# EAGLE schematic PIR_MOC_2 (EAGLE 6.6.0)
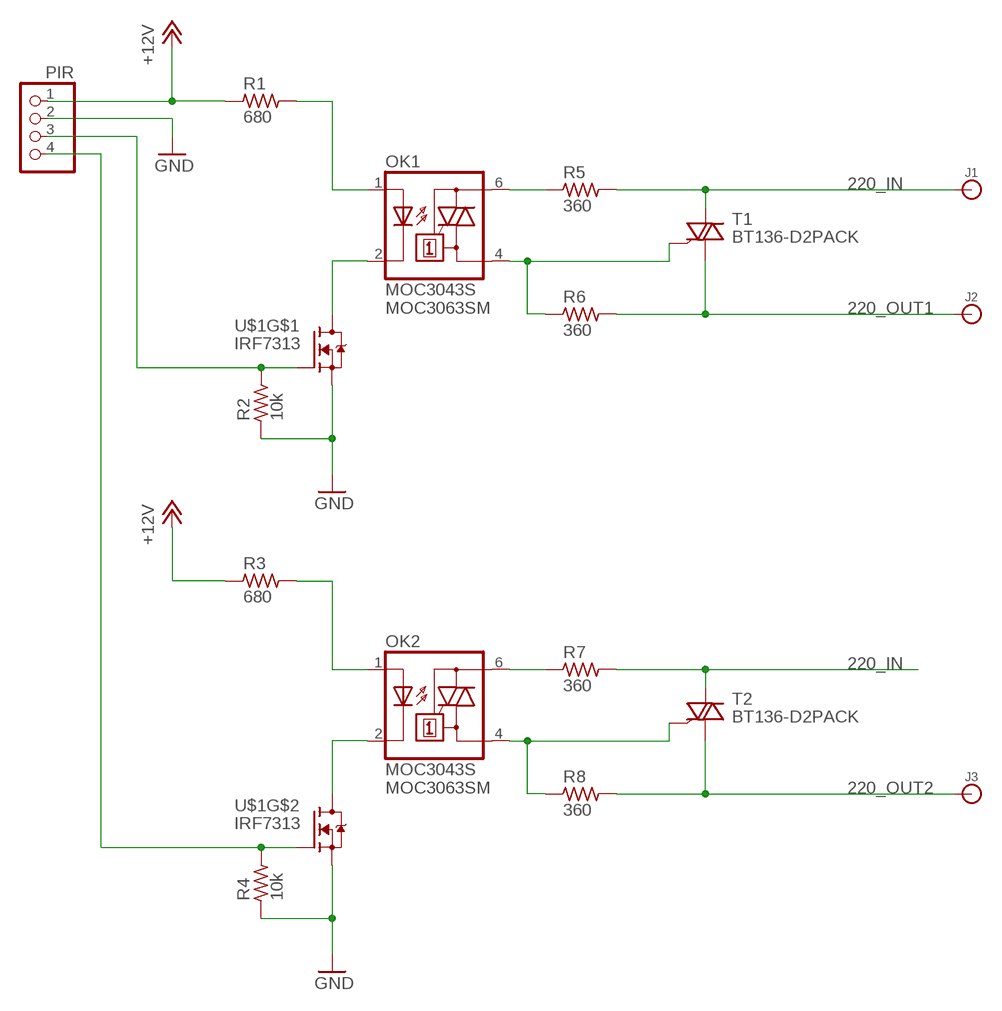
[diagram p0: schematic, sheet 1]

## Parts
J1  BANANA_CONN  [BANANA_CONN]
J2  BANANA_CONN  [BANANA_CONN]
J3  BANANA_CONN  [BANANA_CONN]
OK1  MOC3043S  [DIL6-SMD]
OK2  MOC3043S  [DIL6-SMD]
PIR  PINHD-1X04_2.54-S  [1X04-S]
R1  680  R_1206  [R1206]
R2  10k  R_1206  [R1206]
R3  680  R_1206  [R1206]
R4  10k  R_1206  [R1206]
R5  360  R_1206  [R1206]
R6  360  R_1206  [R1206]
R7  360  R_1206  [R1206]
R8  360  R_1206  [R1206]
T1  BT136-D2PACK  [TO263]
T2  BT136-D2PACK  [TO263]
U$1  IRF7313  [SO-8]

## Nets
220_IN: J1.P$1 R5.2 R7.2 T1.3(A2) T2.3(A2)
220_MOC_AC: OK1.6(A2) R5.1
220_MOC_AC1: OK2.6(A2) R7.1
220_MOC_N: OK1.4(A1) R6.1 T1.2(G)
220_MOC_N1: OK2.4(A1) R8.1 T2.2(G)
220_OUT1: J2.P$1 R6.2 T1.1(A1)
220_OUT2: J3.P$1 R8.2 T2.1(A1)
+12V: PIR.1 R1.1 R3.1
GND: PIR.2 R2.1 R4.1 U$1.1(S) U$1.3(S)
N$1: OK2.2(C) U$1.5(D) U$1.6(D)
N$2: OK2.1(A) R3.2
N$3: PIR.4 R4.2 U$1.4(G)
N$5: OK1.2(C) U$1.7(D) U$1.8(D)
N$6: OK1.1(A) R1.2
N$7: PIR.3 R2.2 U$1.2(G)

## Library data of the parts
J1-J3 = my-library:BANANA_CONN: Through-hole banana jack
OK1 OK2 = optocoupler:MOC30*: 6-Pin DIP Zero-Cross Optoisolators Triac Driver Output (250/400 Volt Peak) Source: Data sheet <http://www.fairchildsemi.com/ds/MO/MOC3031M.pdf> The old path of data sheet not more available 2013-05-06.; MF: FAIRCHILD SEMICONDUCTOR; MPN: MOC3063SM; OC_FARNELL: 1505441; OC_NEWARK: 78K6091
PIR = pinhead-2:PINHD-1X04: PIN HEADER
R1-R8 = rc-master-smd:R_: RESISTOR
T1 T2 = my-library:BT136: Triac BT136 series E sensitive gate Source: http://www.nxp.com/acrobat_download/datasheets/BT136_SERIES_E_2.pdf
U$1 = my-library:IRF7313